# EAGLE schematic omo_v2 (EAGLE 7.3.0)
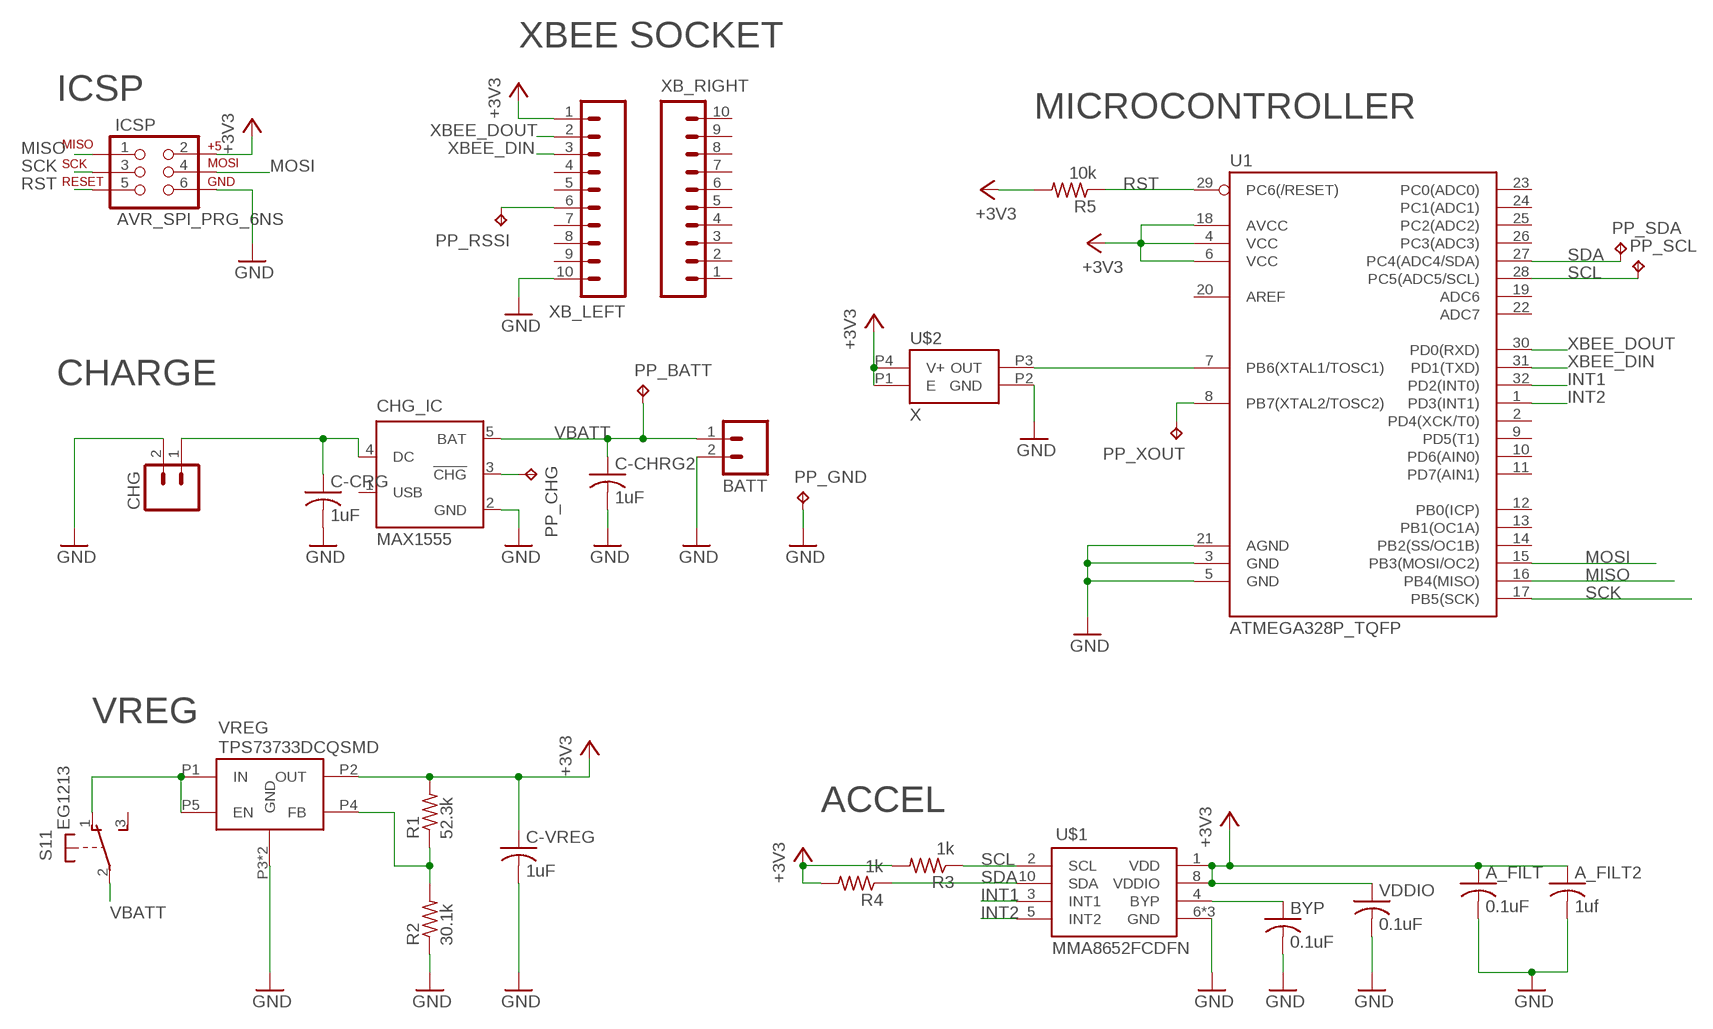
[diagram p0: schematic, sheet 1]

## Parts
A_FILT  0.1uF  C-USC0805  [C0805]
A_FILT2  1uf  C-USC0805  [C0805]
BATT  M02-JST-2-PTH-NO_SILK  [JST-2-PTH-NS]
BYP  0.1uF  C-USC0805  [C0805]
C-CHRG2  1uF  C-USC0805  [C0805]
C-CRG  1uF  C-USC0805  [C0805]
C-VREG  1uF  C-USC0805  [C0805]
CHG  M02-JST-2-PTH-NO_SILK  [JST-2-PTH-NS]
CHG_IC  MAX1555  [SOT23-5L]
ICSP  AVR_SPI_PRG_6NS  [2X3-NS]
PP_BATT  TPB1,27  [B1,27]
PP_CHG  TPB1,27  [B1,27]
PP_GND  TPB1,27  [B1,27]
PP_RSSI  TPB1,27  [B1,27]
PP_SCL  TPB1,27  [B1,27]
PP_SDA  TPB1,27  [B1,27]
PP_XOUT  TPB1,27  [B1,27]
R1  52.3k  R-US_R0805  [R0805]
R2  30.1k  R-US_R0805  [R0805]
R3  1k  R-US_R0805  [R0805]
R4  1k  R-US_R0805  [R0805]
R5  10k  R-US_R0805  [R0805]
S1  EG1213  [EG1213]
U1  ATMEGA328P_TQFP  [TQFP32-08]
U$1  MMA8652FCDFN  [MMA8652FC]
U$2  X  QX3-XSTAL-3V33V3-SMD  [QX3-OSC-3.2X2.5]
VDDIO  0.1uF  C-USC0805  [C0805]
VREG  TPS73733DCQSMD  [SOT-223-6]
XB_LEFT  M102MM  [1X10-2MM]
XB_RIGHT  M102MM  [1X10-2MM]

## Nets
+3V3: A_FILT2.1 A_FILT.1 C-VREG.1 ICSP.2 R1.2 R3.2 R4.2 R5.2 U1.4(VCC) U1.6(VCC) U1.18(AVCC) U$1.1(VDD) U$1.8(VDDIO) U$2.P1(E) U$2.P4(V+) VDDIO.1 VREG.P2(OUT) XB_LEFT.1
GND: A_FILT2.2 A_FILT.2 BATT.2 BYP.2 C-CHRG2.2 C-CRG.2 C-VREG.2 CHG.2 CHG_IC.2(GND) ICSP.6 PP_GND.TP R2.1 U1.3(GND) U1.5(GND) U1.21(AGND) U$1.6(GND) U$1.7(GND) U$1.9(GND) U$2.P2(GND) VDDIO.2 VREG.P3(GND) VREG.P6(GND) XB_LEFT.10
INT1: U1.32(PD2(INT0)) U$1.3(INT1)
INT2: U1.1(PD3(INT1)) U$1.5(INT2)
MISO: ICSP.1 U1.16(PB4(MISO))
MOSI: ICSP.4 U1.15(PB3(MOSI/OC2))
N$1: CHG_IC.3(!CHG) PP_CHG.TP
N$2: PP_RSSI.TP XB_LEFT.6
N$3: R1.1 R2.2 VREG.P4(FB)
N$4: S1.1(1:O) VREG.P1(IN) VREG.P5(EN)
N$6: PP_XOUT.TP U1.8(PB7(XTAL2/TOSC2))
N$7: U1.7(PB6(XTAL1/TOSC1)) U$2.P3(OUT)
N$8: BYP.1 U$1.4(BYP)
RST: ICSP.5 R5.1 U1.29(PC6(/RESET))
SCK: ICSP.3 U1.17(PB5(SCK))
SCL: PP_SCL.TP R3.1 U1.28(PC5(ADC5/SCL)) U$1.2(SCL)
SDA: PP_SDA.TP R4.1 U1.27(PC4(ADC4/SDA)) U$1.10(SDA)
VBATT: BATT.1 C-CHRG2.1 CHG_IC.5(BAT) PP_BATT.TP S1.2(1:P)
VUSB: C-CRG.1 CHG.1 CHG_IC.4(DC)
XBEE_DIN: U1.31(PD1(TXD)) XB_LEFT.3
XBEE_DOUT: U1.30(PD0(RXD)) XB_LEFT.2
Unconnected: CHG_IC.1(USB) S1.3(1:S) S1.MT1(MT) S1.MT2(MT) U1.2(PD4(XCK/T0)) U1.9(PD5(T1)) U1.10(PD6(AIN0)) U1.11(PD7(AIN1)) U1.12(PB0(ICP)) U1.13(PB1(OC1A)) U1.14(PB2(SS/OC1B)) U1.19(ADC6) U1.20(AREF) U1.22(ADC7) U1.23(PC0(ADC0)) U1.24(PC1(ADC1)) U1.25(PC2(ADC2)) U1.26(PC3(ADC3)) XB_LEFT.4 XB_LEFT.5 XB_LEFT.7 XB_LEFT.8 XB_LEFT.9 XB_RIGHT.1 XB_RIGHT.2 XB_RIGHT.3 XB_RIGHT.4 XB_RIGHT.5 XB_RIGHT.6 XB_RIGHT.7 XB_RIGHT.8 XB_RIGHT.9 XB_RIGHT.10

## Notes on the sheet
- XBEE SOCKET
- ICSP
- MICROCONTROLLER
- CHARGE
- VREG
- ACCEL

## Library data of the parts
A_FILT A_FILT2 BYP C-CHRG2 C-CRG C-VREG VDDIO = adafruit:C-US: CAPACITOR, American symbol
BATT CHG = SparkFun-Connectors:M02: Standard 2-pin 0.1" header. Use with - straight break away headers ( PRT-00116) - right angle break away headers (PRT-00553) - swiss pins (PRT-00743) - machine pins (PRT-00117) - female headers (PRT-00115) Molex polarized connector foot print use with: PRT-08233 with associated crimp pins and housings. 2.54_SCREWTERM for use with PRT-10571. 3.5mm Screw Terminal footprints for PRT-08084 5mm Screw Terminal footprints for use with PRT-08432
CHG_IC = maxim:MAX1555: Dual-Input USB/AC Adapter 1-Cell Li+ Battery Chargers Source: http://www.maxim-ic.com .. MAX1551-MAX1555.pdf; MF: MAXIM; MPN: MAX1555EZK+T; OC_FARNELL: 1628222; OC_NEWARK: 59J2761
ICSP = SparkFun-Connectors:AVR_SPI_PRG_6: AVR ISP 6 Pin This is the reduced ISP connector for AVR programming. Common on Arduino. This footprint will take up less PCB space and can be used with a 10-pin to 6-pin adapter such as SKU: BOB-08508 **Special note about "TEST_POINT" package. The stop mask is on the top side, so if you want your programming test points to be on the bottom of your board, make sure to place this package on the bottom side of the board. This also ensure that the orientation to program from the bottom side will be correct.
PP_BATT PP_CHG PP_GND PP_RSSI PP_SCL PP_SDA PP_XOUT = testpad:TP: Test pad
R1-R5 = adafruit:R-US_: RESISTOR, American symbol
S1 = adafruit:EG1213: E-Switch right-angle slide SPDT Part #EG1213 http://www.ladyada.net/library/eagle
U1 = SparkFun-DigitalIC:ATMEGA328P_TQFP; PROD_ID: IC-09069
U$1 = NicShackle:MMA8652FC: MMA8652FC 3 axis accel. 3V3 device. 2,4,8+-G. up to 800Hz data rate. 12-bit data output. High and low pass filters. I2C comm. Single Quant price as at april 16: R21.1 (min order:5). http://za.rs-online.com/web/p/accelerometer-ics/8016889/? Datasheet: http://docs-europe.electrocomponents.com/webdocs/12de/0900766b812de9b9.pdf
U$2 = NicShackle:QX3-XSTAL-3V3: QX3 oscillator - 3.3mm x 2.5mm. Datasheet: http://docs-europe.electrocomponents.com/webdocs/12e7/0900766b812e7647.pdf Singe price as at Apr 2016: R17.00.
VREG = NicShackle:TPS73733DCQ: TPS73733DCQR Ultra low drop-out adjustable voltage regulator. Well suited to LiPo applications, as this will still work down to 3.7V. Dropout Voltage: 130 mV Typical at 1A. Adjustable Output: 1.20 V to 5.5 V. Current Rating: 1A. Single quant price (as at 5 Apr 2016): R21. RS stock no.817-5405.
XB_LEFT XB_RIGHT = SparkFun-Connectors:M10: Header 10 Standard 10-pin 0.1" header. Use with straight break away headers (SKU : PRT-00116), right angle break away headers (PRT-00553), swiss pins (PRT-00743), machine pins (PRT-00117), and female headers (PRT-00115).